# Altium schematic sheet M4QIDB-SCH-01 Sheet1.SchDoc: Power supply, Qi Charger
size Letter; Author: JRL; Organization: Engenuics Technologies Inc; Address1: 88 Dalhurst Way NW; Address2: CALGARY AB; Address3: CANADA T3A 1N7; Address4: 1-888-912-3451; DocumentNumber: M4QIDB-SCH; Revision: 01; SheetNumber: 1; SheetTotal: 3
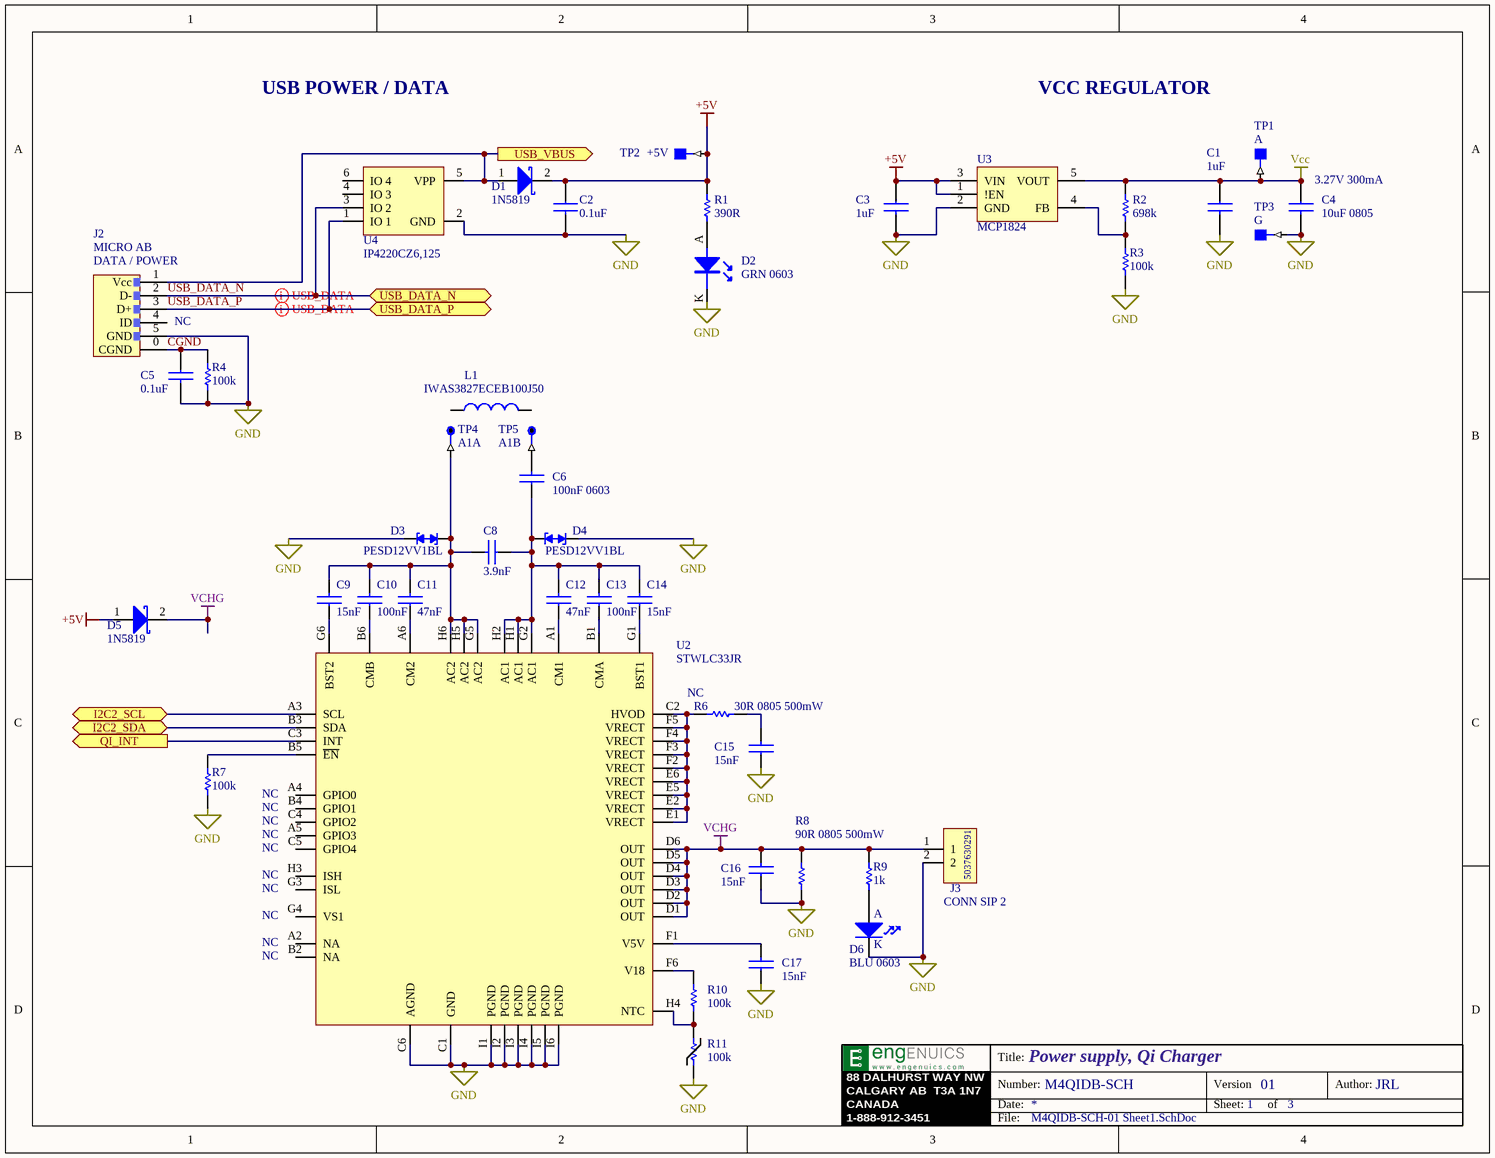
[diagram p0: M4QIDB-SCH-01 Sheet1.SchDoc]

## Parts
C1  1uF  [0603 CAP3D]
C2  0.1uF  [0603 CAP3D]
C3  1uF  [0603 CAP3D]
C4  10uF 0805  [0805 CAP3D]
C5  0.1uF  [0603 CAP3D]
C6  100nF 0603  [0603 CAP3D]
C8  3.9nF  [0603 CAP3D]
C9  15nF  [0603 CAP3D]
C10  100nF  [0603 CAP3D]
C11  47nF  [0603 CAP3D]
C12  47nF  [0603 CAP3D]
C13  100nF  [0603 CAP3D]
C14  15nF  [0603 CAP3D]
C15  15nF  [0603 CAP3D]
C16  15nF  [0603 CAP3D]
C17  15nF  [0603 CAP3D]
D1  1N5819  [SOD123]
D2  GRN 0603  [0603 AK]
D3  PESD12VV1BL  [SOD882]
D4  PESD12VV1BL  [SOD882]
D5  1N5819  [SOD123]
D6  BLU 0603  [0603 AK]
J2  MICRO AB  [CONN USB MICRO B SMT LEGS FCI 10118193]
J3  CONN SIP 2  [HDR1X2]
L1  IWAS3827ECEB100J50  [HDR1X2 NP]  (mechanical)
R1  390R  [0603]
R2  698k  [0603]
R3  100k  [0603]
R4  100k  [0603]
R6  30R 0805 500mW  [0805]
R7  100k  [0603]
R8  90R 0805 500mW  [0805]
R9  1k  [0603]
R10  100k  [0603]
R11  100k  [0603]
TP1  A  [TEST POINT SMT]  (no BOM)
TP2  +5V  [TEST POINT SMT]  (no BOM)
TP3  G  [TEST POINT SMT]  (no BOM)
TP4  A1A  [TEST POINT THRU HOLE]  (no BOM)
TP5  A1B  [TEST POINT THRU HOLE]  (no BOM)
U2  STWLC33JR  [FLIP CHIP 3.97x2.67mm]
U3  MCP1824  [SOT23-5]
U4  IP4220CZ6,125  [TSOP95P280X110-6N]

## Ports
I2C2_SCL (bidir), I2C2_SDA (bidir), QI_INT (out), USB_DATA_N (bidir), USB_DATA_P (bidir), USB_VBUS (out)

## Nets
+5V: C2.1 C3.1 D1.2 D5.1 R1.2 TP2.1 U3.1(!EN) U3.3(VIN)
GND: C1.2 C2.2 C3.2 C4.2 C5.2 C15.1 C16.1 C17.1 D2.K(K1) D3.2 D4.2 D6.K J2.5(GND) J3.2 R3.2 R4.1 R7.2 R8.2 R11.2 TP3.1 U2.C1(GND) U2.C6(AGND) U2.I1(PGND) U2.I2(PGND) U2.I3(PGND) U2.I4(PGND) U2.I5(PGND) U2.I6(PGND) U3.2(GND) U4.2(GND)
Vcc: C1.1 C4.1 R2.2 TP1.1 U3.5(VOUT)
VCHG: C16.2 D5.2 J3.1 R8.1 R9.1 U2.D1(OUT) U2.D2(OUT) U2.D3(OUT) U2.D4(OUT) U2.D5(OUT) U2.D6(OUT)
CGND: C5.1 J2.0(CGND) R4.2
I2C2_SCL: U2.A3(SCL) ; port I2C2_SCL
I2C2_SDA: U2.B3(SDA) ; port I2C2_SDA
QI_INT: U2.C3(INT) ; port QI_INT
USB_DATA_N: J2.2(D-) U4.3(IO_2) ; port USB_DATA_N
USB_DATA_P: J2.3(D+) U4.1(IO_1) ; port USB_DATA_P
USB_VBUS: D1.1 J2.1(Vcc) U4.5(VPP) ; port USB_VBUS
NetC6_1: C6.1 C8.1 C12.2 C13.2 C14.2 D4.1 U2.G2(AC1) U2.H1(AC1) U2.H2(AC1)
NetC6_2: C6.2 TP5.1
NetC8_2: C8.2 C9.2 C10.2 C11.2 D3.1 TP4.1 U2.G5(AC2) U2.H5(AC2) U2.H6(AC2)
NetC9_1: C9.1 U2.G6(BST2)
NetC10_1: C10.1 U2.B6(CMB)
NetC11_1: C11.1 U2.A6(CM2)
NetC12_1: C12.1 U2.A1(CM1)
NetC13_1: C13.1 U2.B1(CMA)
NetC14_1: C14.1 U2.G1(BST1)
NetC15_2: C15.2 R6.2
NetC17_2: C17.2 U2.F1(V5V)
NetD2_A: D2.A(A1) R1.1
NetD6_A: D6.A R9.2
NetR2_1: R2.1 R3.1 U3.4(FB)
NetR6_1: R6.1 U2.C2(HVOD) U2.E1(VRECT) U2.E2(VRECT) U2.E5(VRECT) U2.E6(VRECT) U2.F2(VRECT) U2.F3(VRECT) U2.F4(VRECT) U2.F5(VRECT)
NetR7_1: R7.1 U2.B5(~{EN})
NetR10_1: R10.1 U2.F6(V18)
NetR10_2: R10.2 R11.1 U2.H4(NTC)

Not connected (* = marked no-connect by the designer): J2 4(ID); L1 1 2; U2 A2(NA) A4(GPIO0) A5(GPIO3) B2(NA) B4(GPIO1) C4(GPIO2) C5(GPIO4) G3(ISL) G4(VS1) H3(ISH); U4 4(IO_3) 6(IO_4)

## Layout directives
differential pair: USB_DATA_N, USB_DATA_P

## Notes on the sheet
- USB POWER / DATA
- VCC REGULATOR
- (near C4) 3.27V 300mA
- (near J2) DATA / POWER
- NC
- (near R6) NC
- (near U2) NC
- 88 DALHURST WAY NW
- CALGARY AB  T3A 1N7
- CANADA
- Title:
- Number:
- Date:
- Version
- Sheet:
- of
- Author:
- 1-888-912-3451
- File:

## Library data of the parts
C1 C3 = CAPACITOR NON-POLARIZED: 3. Manufacturer Part Number: EMK107BJ105KA-T; 2. Manufacturer: Taiyo; 5. Internal Part Number: 100009; 1. Description: CAP CER 1uF 10% X5R 16V 0603 SMT; 7. Modified By: JRL; 4. Digi-Key Part Number: 587-1251-2-ND; 6. Last Modified: 2016-08-04
C2 C5 = CAPACITOR NON-POLARIZED: 3. Manufacturer Part Number: C1608X7R1E104K; 2. Manufacturer: TDK; 5. Internal Part Number: 100130; 1. Description: CAP CER 0.1uF 10% X5R 25V 0603 SMT; 7. Modified By: JRL; 4. Digi-Key Part Number: 445-1316-2-ND; 6. Last Modified: 2016-08-04
C4 = CAPACITOR NON-POLARIZED: 3. Manufacturer Part Number: CL21A106KOQNNNE; 2. Manufacturer: Samsung; 5. Internal Part Number: 100006; 1. Description: CAP CER 10uF 10% 16V X5R 0805; 7. Modified By: JRL; 4. Digi-Key Part Number: 1276-1096-1-ND; 6. Last Modified: 2016-08-04
C6 = CAPACITOR NON-POLARIZED: 3. Manufacturer Part Number: CC0603KRX7R9BB473; 2. Manufacturer: Yageo; 1. Description: CAP CER 0.047UF 50V X7R 0603; 7. Modified By: JRL; 5. Internal Part Number: *; 4. Digi-Key Part Number: 311-1427-2-ND; 6. Last Modified: 2019-01-20
C8 = CAPACITOR NON-POLARIZED: 3. Manufacturer Part Number: CAP CER 3900PF 50V X7R 0402 NEED CROSS; 2. Manufacturer: Murata Electronics North America; 1. Description: CAP CER 3900PF 50V X7R 0402; 7. Modified By: JRL; 5. Internal Part Number: *; 4. Digi-Key Part Number: 490-1307-2-ND; 6. Last Modified: 2019-01-20
C9 C14-C17 = CAPACITOR NON-POLARIZED: 3. Manufacturer Part Number: C0402C153K8PACTU; 2. Manufacturer: KEMET; 1. Description: CAP CER 0.015UF 10V X5R 0402; 7. Modified By: JRL; 5. Internal Part Number: *; 4. Digi-Key Part Number: 399-3011-2-ND; 6. Last Modified: 2019-01-20
C10 C13 = CAPACITOR NON-POLARIZED: 3. Manufacturer Part Number: GRM155R61H104KE14D; 2. Manufacturer: Murata Electronics North America; 1. Description: CAP CER 0.1UF 50V X5R 0402; 7. Modified By: JRL; 5. Internal Part Number: *; 4. Digi-Key Part Number: 490-10697-2-ND; 6. Last Modified: 2019-01-20
C11 C12 = CAPACITOR NON-POLARIZED: 3. Manufacturer Part Number: GRM155R61H473KE19 NEED CROSS; 2. Manufacturer: Murata Electronics North America; 1. Description: CAP CER 0.047UF 50V X5R 0402; 7. Modified By: JRL; 5. Internal Part Number: *; 4. Digi-Key Part Number: 490-12705-2-ND; 6. Last Modified: 2019-01-20
D1 D5 = DIODE SCHOTTKY: 2. Manufacturer: Diodes Inc.; 3. Manufacturer Part Number: 1N5819HW-7-F; 5. Internal Part Number: 100039; 1. Description: DIODE SCHOTTKY 1A 40V SOD123; 7. Modified By: JRL; 4. Digi-Key Part Number: 1N5819HW-FDITR-ND; 6. Last Modified: 2016-08-04
D2 = LED T1-3/4: LED; 2. Manufacturer: Kingbright Corp; 3. Manufacturer Part Number: APT1608SGC; 5. Internal Part Number: 100065; 1. Description: LED 0603 GREEN CLEAR SMD; 7. Modified By: JRL; 4. Digi-Key Part Number: 754-1121-2-ND; 6. Last Modified: 2016-08-04
D3 D4 = DIODE ESD PESD12VVBL: 2. Manufacturer: Nexperia USA Inc.; 3. Manufacturer Part Number: PESD12VV1BL,315; 1. Description: TVS DIODE 12V 38V DFN1006-2; 7. Modified By: JRL; 4. Digi-Key Part Number: 1727-1304-2-ND; 5. Internal Part Number: *; 6. Last Modified: 2019-01-20
D6 = LED AK: 2. Manufacturer: Kingbright; 3. Manufacturer Part Number: APT1608QBC/D; 5. Internal Part Number: 100107; 1. Description: LED 0603 BLUE 470NM WTR CLR SMD; 7. Modified By: JRL; 4. Digi-Key Part Number: 754-1434-1-ND; 6. Last Modified: 2019-01-20
J2 = CONN USB MICRO AB FCI 10104111: 2. Manufacturer: FCI; 3. Manufacturer Part Number: 10104111-0001LF; 5. Internal Part Number: 100182; 1. Description: CONN RCPT STD MICRO USB TYPE AB; 7. Modified By: JRL; 4. Digi-Key Part Number: 609-4053-1-ND; 6. Last Modified: 2012-09-03
J3 = CONN 2POS MOLEX 5037630291: 2. Manufacturer: MOLEX; 1. Description: CONN HEADER 1MM R/A 2CKT; 7. Modified By: JRL; 3. Manufacturer Part Number: 5037630291; 4. Digi-Key Part Number: WM10654TR-ND; 5. Internal Part Number: *; 6. Last Modified: 2015-12-08
L1 = INDUCTOR: 1. Description: INDUCTOR [TYPE] [VALUE] [TOLERANCE] [PACKAGE] [CURRENT] [DCR]; 2. Manufacturer: *; 3. Manufacturer Part Number: *; 4. Digi-Key Part Number: *; 5. Internal Part Number: *; 6. Last Modified: *; 7. Modified By: *
R1 = RESISTOR: 2. Manufacturer: Yageo; 3. Manufacturer Part Number: RC0603FR-07390RL; 5. Internal Part Number: 100098; 1. Description: RES 390 OHM 1/10W 1% 0603; 7. Modified By: JRL; 4. Digi-Key Part Number: 311-390HRTR-ND; 6. Last Modified: 2013-06-26
R2 = RESISTOR: 2. Manufacturer: Yageo; 3. Manufacturer Part Number: RC0603FR-07698KL; 1. Description: RES 698K OHM 1/10W 1% 0603 SMD; 7. Modified By: JRL; 4. Digi-Key Part Number: 311-698KHRCT-ND; 6. Last Modified: 2011-08-14
R3 R4 = RESISTOR: 2. Manufacturer: Yageo; 3. Manufacturer Part Number: RC0603FR-07100KL; 5. Internal Part Number: 100078; 1. Description: RES 100K OHM 1/10W 1% 0603 SMD; 7. Modified By: JRL; 4. Digi-Key Part Number: 311-100KHRTR-ND; 6. Last Modified: 2016-08-04
R6 R8 = RESISTOR: 2. Manufacturer: Panasonic Electronic Components; 3. Manufacturer Part Number: ERJ-P6WF30R0V; 1. Description: RES SMD 30 OHM 1% 1/2W 0805; 7. Modified By: JRL; 5. Internal Part Number: *; 4. Digi-Key Part Number: ERJ-P6WF30R0V-ND; 6. Last Modified: 2018-11-22
R7 R9-R11 = RESISTOR: 1. Description: RES [VALUE] [POWER] [TOLERANCE] [PACKAGE] [CONSTRUCTION]; 5. Internal Part Number: *; 4. Digi-Key Part Number: *; 2. Manufacturer: *; 3. Manufacturer Part Number: *; 6. Last Modified: *; 7. Modified By: *
TP1-TP3 = TEST POINT SMT: 1. Description: Test pad; 7. Modified By: JRL; 2. Manufacturer: N/A; 3. Manufacturer Part Number: N/A; 4. Digi-Key Part Number: N/A
  TP1 TP3: 6. Last Modified: 2012-12-16
  TP2: 5. Internal Part Number: N/A; 6. Last Modified: June 12, 2008
TP4 TP5 = TEST POINT THRU HOLE: 1. Description: TEST PAD THROUGH-HOLE; 7. Modified By: JRL; 2. Manufacturer: N/A; 3. Manufacturer Part Number: N/A; 4. Digi-Key Part Number: N/A; 5. Internal Part Number: N/A; 6. Last Modified: June 12, 2008
U2 = IC WIRESLESS CHARGER STWLC33JR: 2. Manufacturer: STM; 1. Description: IC WIRELESS POWER RECEIVER 52CSP; 7. Modified By: JRL; 3. Manufacturer Part Number: STWLC33JR; 4. Digi-Key Part Number: 497-17649-2-ND; 5. Internal Part Number: *; 6. Last Modified: 2019-01-20
U3 = VREG MCP1824: 2. Manufacturer: Microchip; 3. Manufacturer Part Number: MCP1824T-ADJE/OT; 1. Description: IC LDO REG 300MA ADJ-V SOT23-5; 7. Modified By: JRL; 4. Digi-Key Part Number: MCP1824T-ADJE/OTCT-ND; 6. Last Modified: 2011-08-14
U4 = IC ESD USB DUAL NXP IP4220CZ6: 2. Manufacturer: NXP; 5. Internal Part Number: 100225; 1. Description: IC USB DUAL ESD PROTECT 6TSOP; 7. Modified By: JRL; 3. Manufacturer Part Number: IP4220CZ6,125; 4. Digi-Key Part Number: 568-3529-6-ND; 6. Last Modified: 2013-05-14